# EAGLE schematic LED Bar Board (EAGLE 8.3.2)
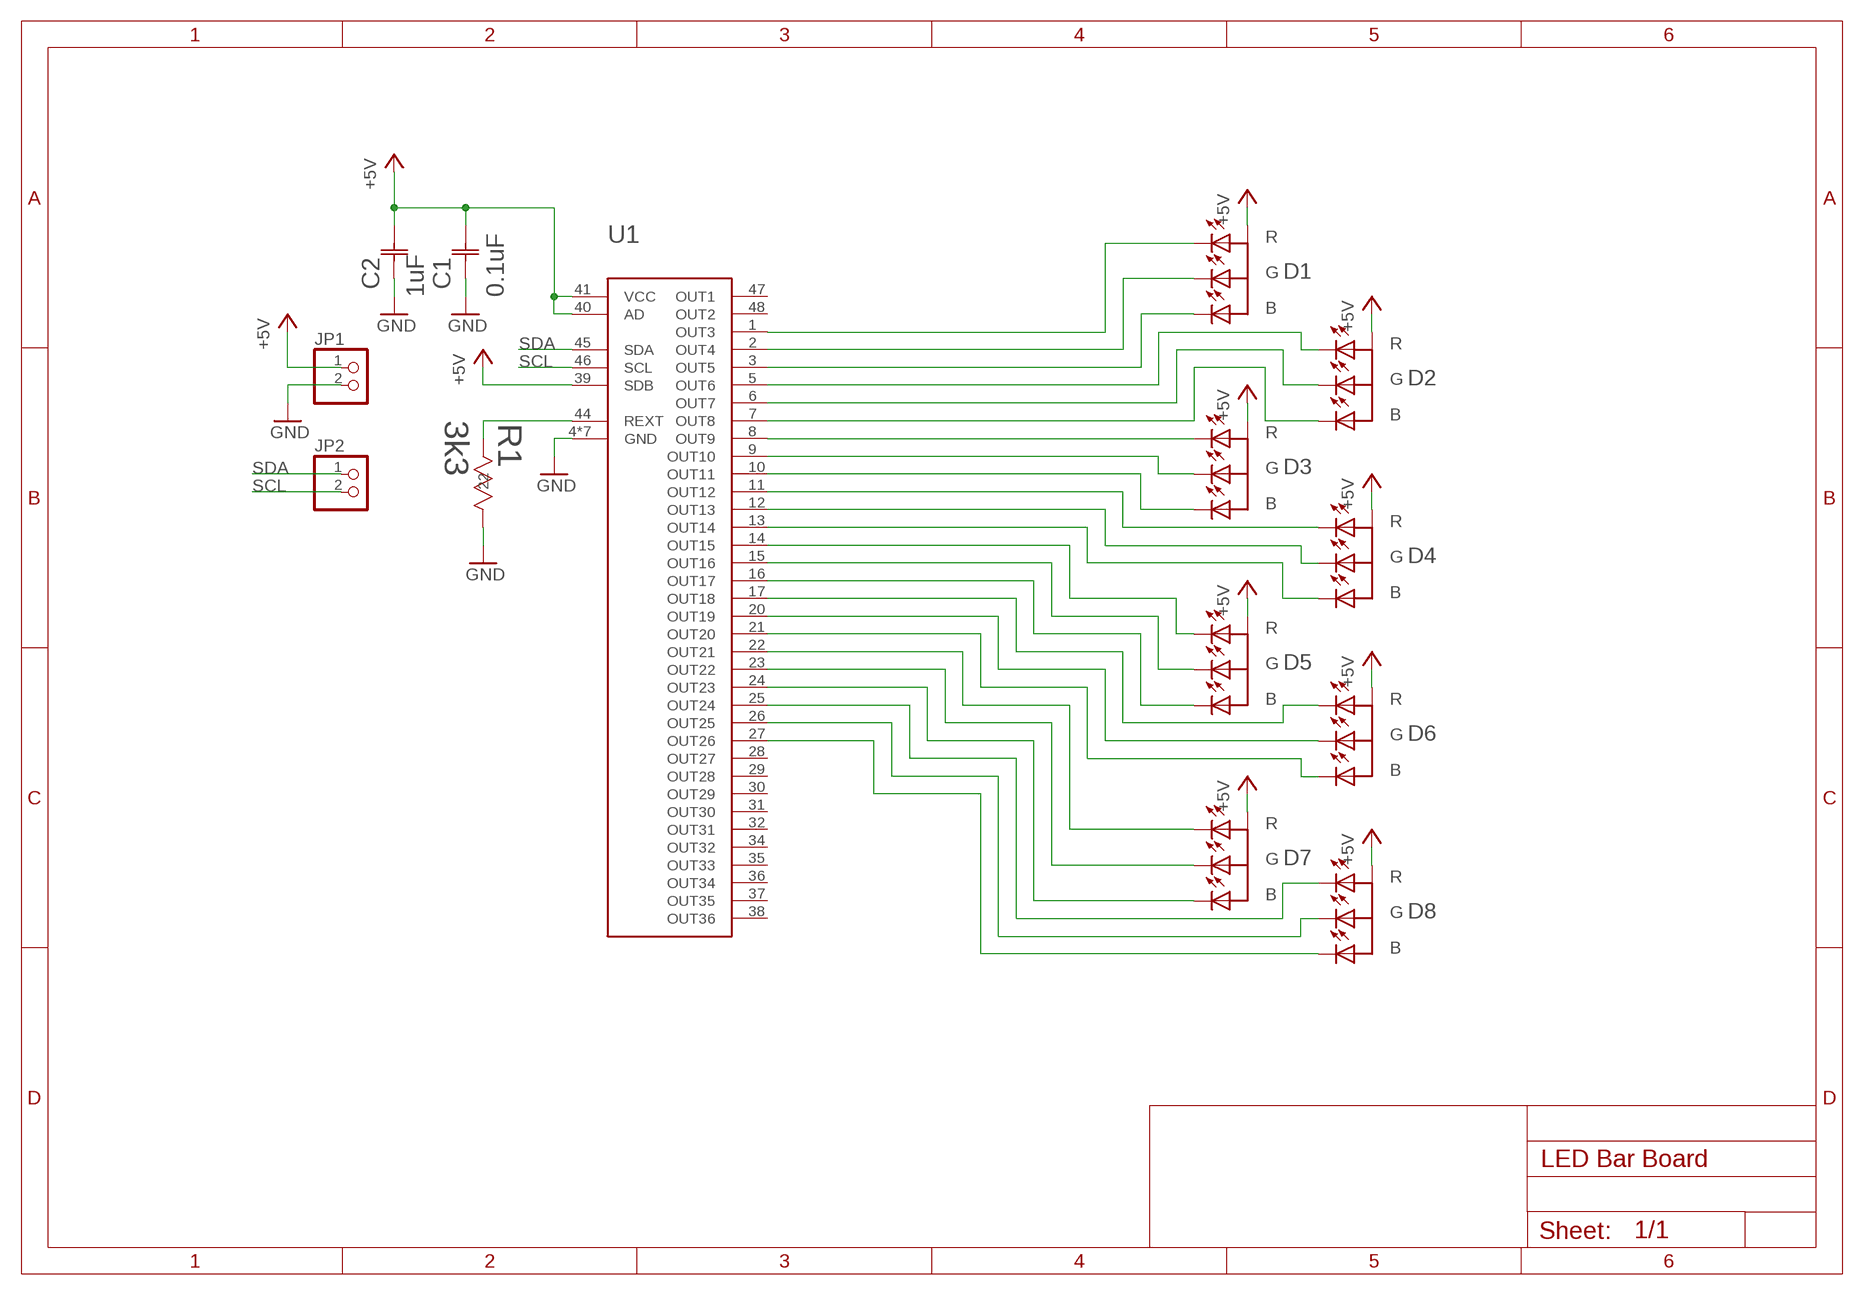
[diagram p0: schematic, sheet 1]

## Parts
C1  0.1uF  08055C104KAT2A  [0805]
C2  1uF  CC0805KKX7R7BB105  [YAG_CC0805]
D1  ASMB-MTB0-0A3A2  [ASMB-MTB0_LED]
D2  ASMB-MTB0-0A3A2  [ASMB-MTB0_LED]
D3  ASMB-MTB0-0A3A2  [ASMB-MTB0_LED]
D4  ASMB-MTB0-0A3A2  [ASMB-MTB0_LED]
D5  ASMB-MTB0-0A3A2  [ASMB-MTB0_LED]
D6  ASMB-MTB0-0A3A2  [ASMB-MTB0_LED]
D7  ASMB-MTB0-0A3A2  [ASMB-MTB0_LED]
D8  ASMB-MTB0-0A3A2  [ASMB-MTB0_LED]
JP1  PINHD-1X2  [1X02]
JP2  PINHD-1X2  [1X02]
R1  3k3  RC1206JR-073K3LRC1206N-M  [RC1206N-M]
U1  IS31FL3236  [TQFP-48]

## Nets
+5V: C1.2 C2.2 D1.1(A) D2.1(A) D3.1(A) D4.1(A) D5.1(A) D6.1(A) D7.1(A) D8.1(A) JP1.1 U1.39(SDB) U1.40(AD) U1.41(VCC)
GND: C1.1 C2.1 JP1.2 R1.1 U1.4(GND) U1.18(GND) U1.19(GND) U1.33(GND) U1.42(GND) U1.43(GND) U1.EP(GND)
N$1: D1.4(R) U1.1(OUT3)
N$2: D1.3(G) U1.2(OUT4)
N$3: D2.3(G) U1.6(OUT7)
N$4: D1.2(B) U1.3(OUT5)
N$5: D2.4(R) U1.5(OUT6)
N$6: R1.2 U1.44(REXT)
N$7: D3.4(R) U1.8(OUT9)
N$8: D3.3(G) U1.9(OUT10)
N$9: D3.2(B) U1.10(OUT11)
N$10: D4.4(R) U1.11(OUT12)
N$11: D4.3(G) U1.12(OUT13)
N$12: D4.2(B) U1.13(OUT14)
N$13: D5.4(R) U1.14(OUT15)
N$14: D5.3(G) U1.15(OUT16)
N$15: D5.2(B) U1.16(OUT17)
N$16: D6.4(R) U1.17(OUT18)
N$17: D6.3(G) U1.20(OUT19)
N$18: D6.2(B) U1.21(OUT20)
N$19: D7.4(R) U1.22(OUT21)
N$20: D7.3(G) U1.23(OUT22)
N$21: D7.2(B) U1.24(OUT23)
N$22: D8.4(R) U1.25(OUT24)
N$23: D8.3(G) U1.26(OUT25)
N$24: D8.2(B) U1.27(OUT26)
N$25: D2.2(B) U1.7(OUT8)
SCL: JP2.2 U1.46(SCL)
SDA: JP2.1 U1.45(SDA)
Unconnected: U1.28(OUT27) U1.29(OUT28) U1.30(OUT29) U1.31(OUT30) U1.32(OUT31) U1.34(OUT32) U1.35(OUT33) U1.36(OUT34) U1.37(OUT35) U1.38(OUT36) U1.47(OUT1) U1.48(OUT2)

## Library data of the parts
C1 = 0.1uF X7R Ceramic Capacitor:08055C104KAT2A; COPYRIGHT: Copyright C 2015 Accelerated Designs. All rights reserved; MANUFACTURER_PART_NUMBER: 08055C104KAT2A; VENDOR: Vendor
C2 = 1uF X7R Ceramic Capacitor:CC0805KKX7R7BB105; COPYRIGHT: Copyright C 2015 Accelerated Designs. All rights reserved; MANUFACTURER_PART_NUMBER: CC0805KKX7R7BB105; VENDOR: Vendor
D1-D8 = thanics_robotics:ASMB-MTB0-0A3A2
JP1 JP2 = pinhead:PINHD-1X2: PIN HEADER
R1 = 3.3k-resistor:RC1206JR-073K3L; MANUFACTURER_PART_NUMBER: RC1206JR073K3L; VENDOR: Yageo
U1 = thanics_robotics:IS31FL3236